# EAGLE design buttonboard-right (EAGLE 6.1)
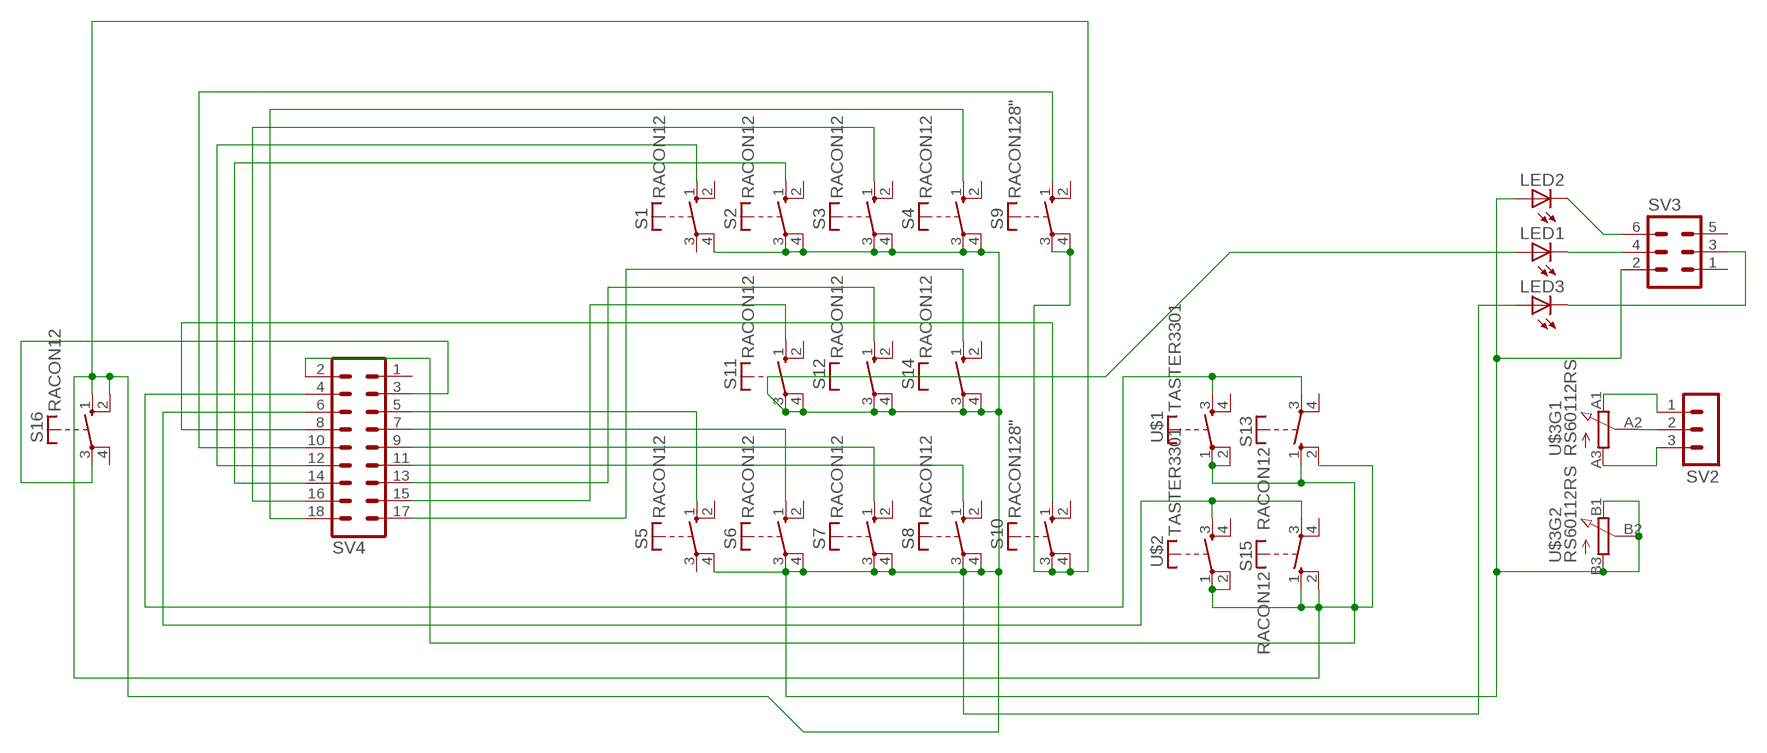
[diagram p0: schematic, sheet 1]

## Parts
LED1  LED3MM  [LED3MM]
LED2  LED3MM  [LED3MM]
LED3  LED3MM  [LED3MM]
S1  RACON12  [RACON12]
S2  RACON12  [RACON12]
S3  RACON12  [RACON12]
S4  RACON12  [RACON12]
S5  RACON12  [RACON12]
S6  RACON12  [RACON12]
S7  RACON12  [RACON12]
S8  RACON12  [RACON12]
S9  RACON128"  [RACON8]
S10  RACON128"  [RACON8]
S11  RACON12  [RACON12]
S12  RACON12  [RACON12]
S13  RACON12  [RACON12]
S14  RACON12  [RACON12]
S15  RACON12  [RACON12]
S16  RACON12  [RACON12]
SV2  MA03-1  [MA03-1]
SV3  MA03-2  [MA03-2]
SV4  MA09-2  [MA09-2]
U$1  TASTER3301  [3301]
U$2  TASTER3301  [3301]
U$3  RS60112RS  [RS60112]

## Nets
GND: LED1.A LED2.A LED3.A S1.4(P) S2.3(P) S2.4(P) S3.3(P) S3.4(P) S4.3(P) S4.4(P) S5.4(P) S6.3(P) S6.4(P) S7.3(P) S7.4(P) S8.3(P) S8.4(P) S9.3(P) S9.4(P) S10.3(P) S10.4(P) S11.3(P) S11.4(P) S12.3(P) S12.4(P) S13.1(S) S13.2(S) S14.3(P) S14.4(P) S15.1(S) S15.2(S) S16.1(S) S16.2(S) SV3.2 SV4.2 U$1.1(P) U$1.2(P) U$2.1(P) U$2.2(P) U$3.B1(E) U$3.B2(S) U$3.B3(A)
N$1: S10.1(S) SV4.8
N$2: S1.1(S) SV4.12
N$3: S6.1(S) SV4.7
N$4: S2.1(S) SV4.14
N$5: S7.1(S) SV4.9
N$6: S8.1(S) SV4.11
N$7: S5.1(S) SV4.5
N$8: S15.3(P) SV4.6 U$2.3(S)
N$9: S3.1(S) SV4.16
N$10: S13.3(P) SV4.4 U$1.3(S)
N$11: LED2.K(C) SV3.6
N$12: LED1.K(C) SV3.4
N$13: LED3.K(C) SV3.3
N$14: S4.1(S) SV4.18
N$15: SV2.2 U$3.A2(S)
N$16: SV2.1 U$3.A1(E)
N$17: SV2.3 U$3.A3(A)
N$18: S16.3(P) SV4.3
N$19: S12.1(S) SV4.13
N$20: S9.1(S) SV4.10
N$34: S11.1(S) SV4.15
N$35: S14.1(S) SV4.17
Unconnected: S1.2(S) S1.3(P) S2.2(S) S3.2(S) S4.2(S) S5.2(S) S5.3(P) S6.2(S) S7.2(S) S8.2(S) S9.2(S) S10.2(S) S11.2(S) S12.2(S) S13.4(P) S14.2(S) S15.4(P) S16.4(P) SV3.1 SV3.5 SV4.1 U$1.4(S) U$2.4(S)

## Library data of the parts
LED1-LED3 = led:LED: LED OSRAM: - CHIPLED LG R971, LG N971, LY N971, LG Q971, LY Q971, LO R971, LY R971 LH N974, LH R974 LS Q976, LO Q976, LY Q976 LO Q996 - Hyper CHIPLED LW Q18S LB Q993, LB Q99A, LB R99A - SideLED LS A670, LO A670, LY A670, LG A670, LP A670 LB A673, LV A673, LT A673, LW A673 LH A674 LY A675 LS A676, LA A676, LO A676, LY A676, LW A676 LS A679, LY A679, LG A679 - Hyper Micro SIDELED® LS Y876, LA Y876, LO Y876, LY Y876 LT Y87S - SmartLED LW L88C, LW L88S LB L89C, LB L89S, LG L890 LS L89K, LO L89K, LY L89K LS L896, LA L896, LO L896, LY L896 - TOPLED LS T670, LO T670, LY T670, LG T670, LP T670 LSG T670, LSP T670, LSY T670, LOP T670, LYG T670 LG T671, LOG T671, LSG T671 LB T673, LV T673, LT T673, LW T673 LH T674 LS T676, LA T676, LO T676, LY T676, LB T676, LH T676, LSB T676, LW T676 LB T67C, LV T67C, LT T67C, LS T67K, LO T67K, LY T67K, LW E67C LS E67B, LA E67B, LO E67B, LY E67B, LB E67C, LV E67C, LT E67C LW T67C LS T679, LY T679, LG T679 LS T770, LO T770, LY T770, LG T770, LP T770 LB T773, LV T773, LT T773, LW T773 LH T774 LS E675, LA E675, LY E675, LS T675 LS T776, LA T776, LO T776, LY T776, LB T776 LHGB T686 LT T68C, LB T68C - Hyper Mini TOPLED® LB M676 - Mini TOPLED Santana® LG M470 LS M47K, LO M47K, LY M47K Source: http://www.osram.convergy.de LUXEON: - LUMILED® LXK2-PW12-R00, LXK2-PW12-S00, LXK2-PW14-U00, LXK2-PW14-V00 LXK2-PM12-R00, LXK2-PM12-S00, LXK2-PM14-U00 LXK2-PE12-Q00, LXK2-PE12-R00, LXK2-PE12-S00, LXK2-PE14-T00, LXK2-PE14-U00 LXK2-PB12-K00, LXK2-PB12-L00, LXK2-PB12-M00, LXK2-PB14-N00, LXK2-PB14-P00, LXK2-PB14-Q00 LXK2-PR12-L00, LXK2-PR12-M00, LXK2-PR14-Q00, LXK2-PR14-R00 LXK2-PD12-Q00, LXK2-PD12-R00, LXK2-PD12-S00 LXK2-PH12-R00, LXK2-PH12-S00 LXK2-PL12-P00, LXK2-PL12-Q00, LXK2-PL12-R00 Source: www.luxeon.com KINGBRIGHT: KA-3528ASYC Source: www.kingbright.com
S1-S16 = switch-misc:RACON12: ITT SWITCH
SV2 = con-lstb:MA03-1: PIN HEADER; OC_FARNELL: unknown; OC_NEWARK: unknown
SV3 = con-lstb:MA03-2: PIN HEADER; OC_FARNELL: unknown; OC_NEWARK: unknown
SV4 = con-lstb:MA09-2: PIN HEADER; OC_FARNELL: unknown; OC_NEWARK: unknown
U$1 U$2 = switch-misc:TASTER3301: Simple Button, small size. REICHELT TASTER 3301
U$3 = pot:RS60112

## Board
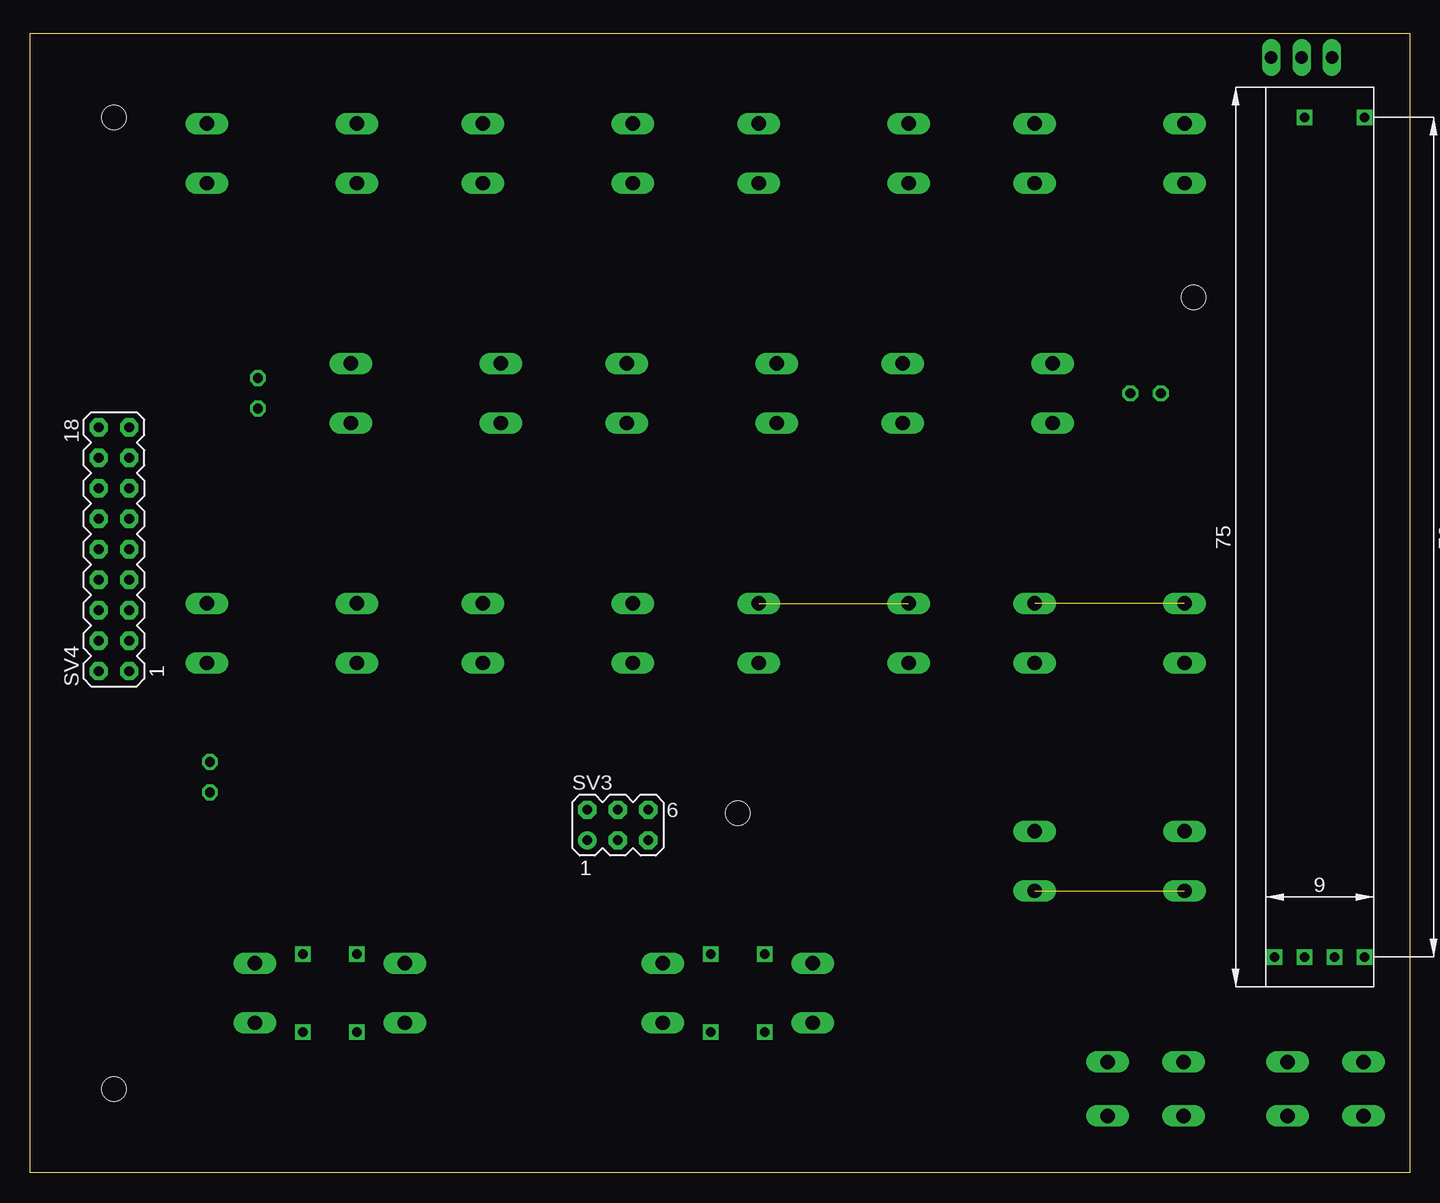
[diagram p1: board, top side]
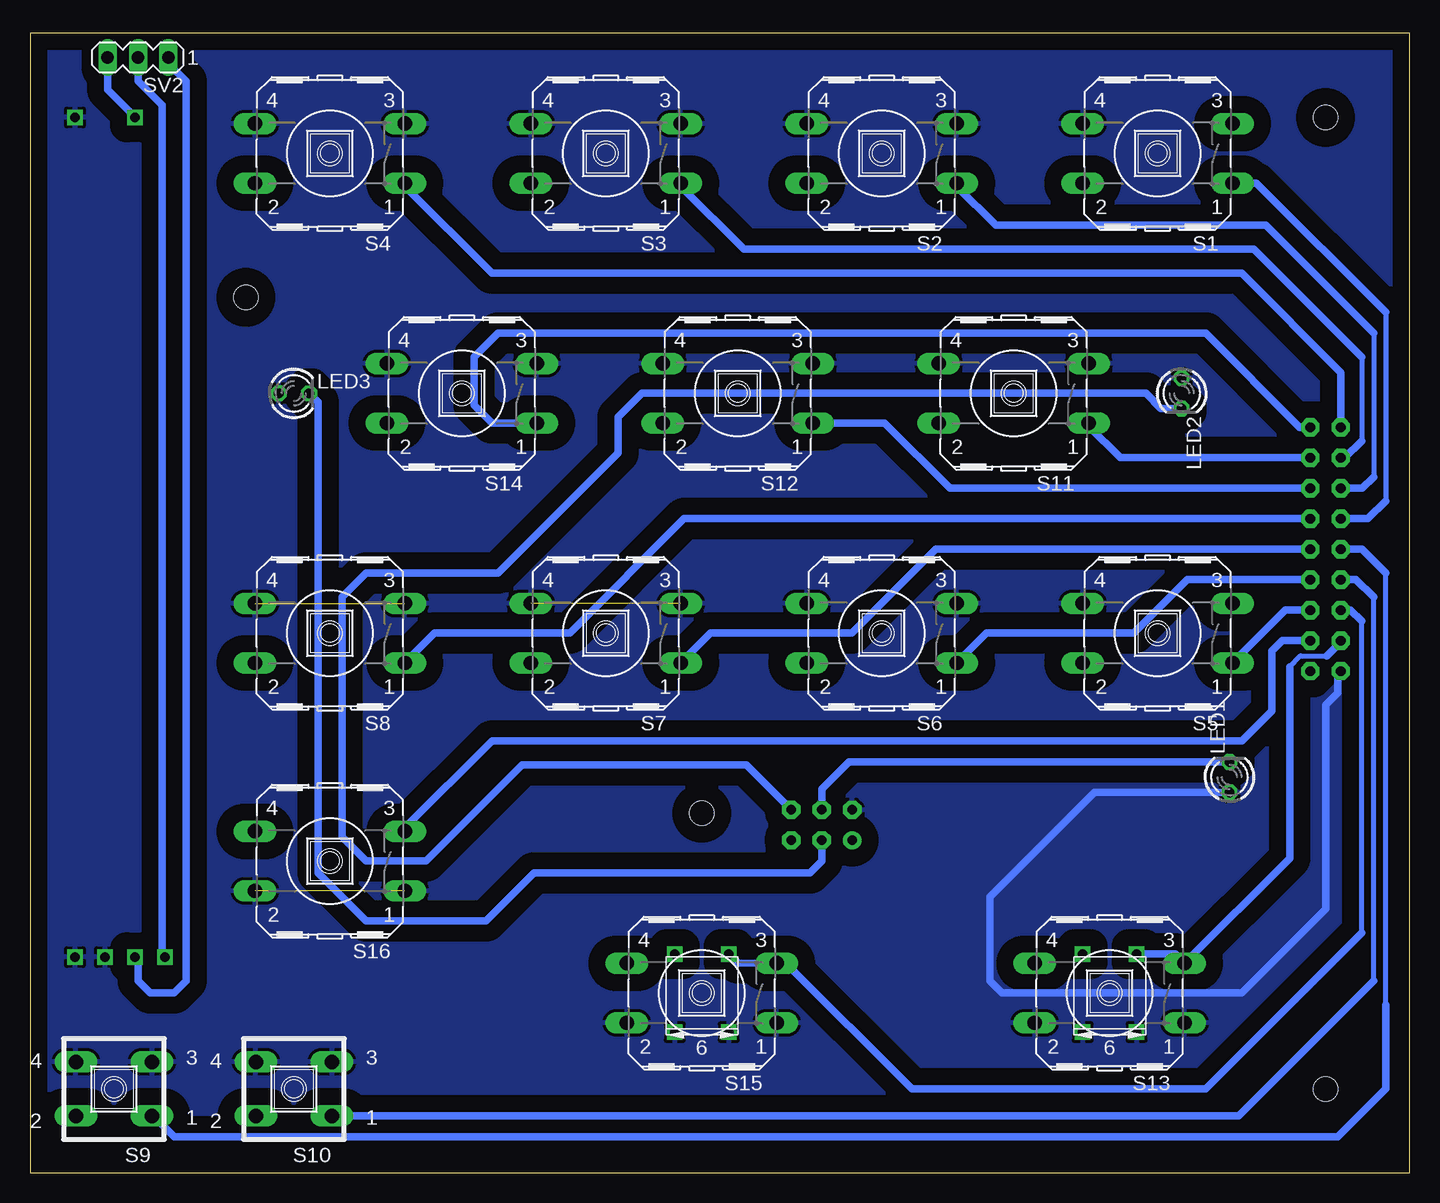
[diagram p2: board, bottom side, seen from below]

Size 115 x 95 mm. Coordinates in mm from the lower left corner, seen from the top.
Outline: 115,0 0,0 0,95 115,95 115,0
Copper layers (1*16): Top 0.035mm / dielectric 1.5mm / Bottom 0.035mm
Design rules: minimum track width 10mil, minimum drill 24mil, track to track 8mil, track to pad 8mil, pad to pad 8mil, via to via 8mil, smd to smd 8mil, copper to edge 40mil, drill to drill 8mil, minimum pad ring 10mil, minimum via ring 8mil, stop-mask expansion 4mil, vias tented up to drill 0mil, thermal gap 10mil
Holes 2 mm at 59,30 7,7 7,88 97,73

### Footprints (pad centres in the part's own frame; a part is rotated, then mirrored left to right if it is on the bottom)
LED3MM = drill 0.813 octagon: A -1.27,0; K 1.27,0
RACON12 = drill 1.194 long: 1 -6.248,2.489; 2 6.248,2.489; 3 -6.248,-2.489; 4 6.248,-2.489
RACON8 = drill 1.194 long: 1 -3.175,2.25; 2 3.175,2.25; 3 -3.175,-2.25; 4 3.175,-2.25
MA03-1 = drill 1.016 long: 1 -2.54,0; 2 0,0; 3 2.54,0
MA03-2 = drill 0.8 pad 1.524: 1 -2.54,-1.27 | drill 0.8 pad 1.524 octagon: 2 -2.54,1.27; 3 0,-1.27; 4 0,1.27; 5 2.54,-1.27; 6 2.54,1.27
MA09-2 = drill 0.8 pad 1.524 octagon: 1 -10.16,-1.27; 2 -10.16,1.27; 3 -7.62,-1.27; 4 -7.62,1.27; 5 -5.08,-1.27; 6 -5.08,1.27; 7 -2.54,-1.27; 8 -2.54,1.27; 9 0,-1.27; 10 0,1.27; 11 2.54,-1.27; 12 2.54,1.27; 13 5.08,-1.27; 14 5.08,1.27; 15 7.62,-1.27; 16 7.62,1.27; 17 10.16,-1.27; 18 10.16,1.27
3301 = drill 0.8 square: 1 -2.25,3.25; 2 2.25,3.25; 3 -2.25,-3.25; 4 2.25,-3.25
RS60112 = drill 0.8 square: A1 -35,1.25; A2 -35,3.75; A3 35,1.25; B1 -35,-3.75; B2 -35,-1.25; B3 35,-3.75

### Placement (x,y rotation side)
LED1  15,33 90 bottom
LED2  19,65 270 bottom
LED3  93,65 0 bottom
S1  21,85 180 bottom
S2  44,85 180 bottom
S3  67,85 180 bottom
S4  90,85 180 bottom
S5  21,45 180 bottom
S6  44,45 180 bottom
S7  67,45 180 bottom
S8  90,45 180 bottom
S9  108,7 180 bottom
S10  93,7 180 bottom
S11  33,65 180 bottom
S12  56,65 180 bottom
S13  25,15 180 bottom
S14  79,65 180 bottom
S15  59,15 180 bottom
S16  90,26 180 bottom
SV2  106,93 180 bottom
SV3  49,29 0 top
SV4  7,52 90 top
U$1  25,15 180 bottom
U$2  59,15 180 bottom
U$3  107.5,53 90 top

### Tracks (layer width: path | path; a pad name or v marks a point on that pad's centre or on a via)
GND  (3 unrouted)
  Bottom 0.61: SV4.2 6,41.57 6,40 7,39 7,22 14,15 34,15 35,16 35,23 26.27,31.73 LED1.A
  pour Bottom (isolate 1.422): 116,96 -1,96 -1,-1 116,-1
N$1
  Bottom 0.406: 3,16 3,48
  Bottom 0.61: 3,48 4.46,49.46 SV4.8 | 3,16 14.25,4.75 S10.1
N$2
  Bottom 0.406: 2,71.76 2,56
  Bottom 0.61: 2,56 3.46,54.54 SV4.12 | 2,71.76 12.75,82.51 S1.1
N$3
  Bottom 0.61: SV4.7 18.54,49.46 23,45 35.26,45 S6.1
N$4
  Bottom 0.406: 3,70 3,58
  Bottom 0.61: 3,70 12,79 34.5,79 37.75,82.25 S2.1 | 3,58 3.92,57.08 SV4.14
N$5
  Bottom 0.61: SV4.9 39.5,52 46.5,45 58.26,45 S7.1
N$6
  Bottom 0.61: SV4.11 60.46,54.54 70,45 81.26,45 S8.1
N$7
  Bottom 0.61: SV4.5 10.34,46.92 14.76,42.5 S5.1
N$8
  Bottom 0.406: 4,20 4,46
  Bottom 0.61: 4,20 17,7 41.5,7 51.99,17.49 S15.3 56,17.5 U$2.3 | 4,46 4.92,46.92 SV4.6
N$9
  Bottom 0.406: 4,68 4,61
  Bottom 0.61: 4,68 13,77 55.5,77 60.75,82.25 S3.1 | 4,61 5.38,59.62 SV4.16
N$10
  Bottom 0.406: 10,42.2 9.1,43.1 6.9,43.1
  Bottom 0.61: 10,42.2 10,26.24 S13.3 19.51,18.25 U$1.3 | 6.9,43.1 5.73,44.27 SV4.4
N$11
  Bottom 0.61: LED2.K 20.73,63.73 22,65 64,65 66,63 66,60 76,50 87,50 89,48 89,28 87,26 82,26 74,34 55.27,34 SV3.6
N$12
  Bottom 0.61: LED1.K 46.73,34.27 49,32 SV3.4
N$13
  Bottom 0.61: SV3.3 49,26 50,25 73,25 77,21 87,21 91,25 91,64.27 LED3.K
N$14
  Bottom 0.61: SV4.18 5.73,66.73 14,75 76.5,75 83.75,82.25 S4.1
N$15
  Bottom 0.61: SV2.2 106,91 104,89 104,18.25 U$3.A2
N$16
  Bottom 0.61: SV2.1 103.46,92.46 102,91 102,16 103,15 105,15 106,16 106,17.75 U$3.A1
N$17
  Bottom 0.61: SV2.3 108.54,90.29 U$3.A3
N$18
  Bottom 0.61: SV4.3 10.62,44.38 11.5,43.5 11.5,38.5 14,36 76.5,36 83.75,28.75 S16.3
N$19
  Bottom 0.61: SV4.13 38.32,57.08 43.75,62.51 S12.1
N$20
  Bottom 0.406: 2,14 2,50
  Bottom 0.61: 2,14 2,7 6,3 103,3 104.75,4.75 S9.1 | 2,50 4,52 SV4.10
N$34
  Bottom 0.61: SV4.15 24.12,59.62 26.75,62.25 S11.1
N$35
  Bottom 0.61: SV4.17 9.16,62.16 17,70 76,70 78,68 78,64 76.5,62.5 S14.1